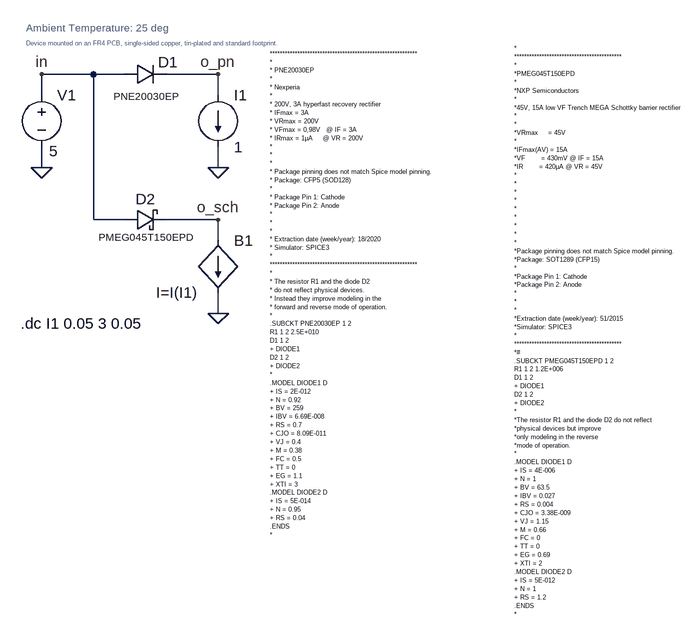
[diagram p0: schematic 02-direct_bias_pn_sch.asc]
02-direct_bias_pn_sch.asc, the LTspice schematic file:
Version 4
SHEET 1 1284 1908
WIRE -16 64 -96 64
WIRE 32 64 -16 64
WIRE 176 64 96 64
WIRE -96 96 -96 64
WIRE 176 96 176 64
WIRE -96 208 -96 176
WIRE 176 208 176 176
WIRE -16 288 -16 64
WIRE 32 288 -16 288
WIRE 176 288 96 288
WIRE 176 320 176 288
WIRE 176 432 176 400
FLAG -96 208 0
FLAG 176 208 0
FLAG -96 64 in
FLAG 176 64 o_pn
FLAG 176 432 0
FLAG 176 288 o_sch
SYMBOL diode 32 80 R270
WINDOW 0 19 67 VTop 2
WINDOW 3 -7 32 VBottom 1
SYMATTR InstName D1
SYMATTR Value PNE20030EP
SYMATTR Prefix X
SYMBOL voltage -96 80 R0
WINDOW 3 12 102 Left 2
WINDOW 123 0 0 Left 0
WINDOW 39 0 0 Left 0
SYMATTR Value 5
SYMATTR InstName V1
SYMBOL current 176 96 R0
WINDOW 123 0 0 Left 0
WINDOW 39 0 0 Left 0
SYMATTR InstName I1
SYMATTR Value 1
SYMBOL schottky 32 304 R270
WINDOW 0 32 32 VTop 2
WINDOW 3 0 32 VBottom 1
SYMATTR InstName D2
SYMATTR Value PMEG045T150EPD
SYMATTR Prefix X
SYMBOL bi 176 320 R0
WINDOW 3 -96 80 Left 2
SYMATTR InstName B1
SYMATTR Value I=I(I1)
TEXT 256 32 Left 0 !***********************************************************\n*\n* PNE20030EP\n*\n* Nexperia\n*\n* 200V, 3A hyperfast recovery rectifier\n* IFmax = 3A\n* VRmax = 200V\n* VFmax = 0,98V   @ IF = 3A\n* IRmax = 1µA     @ VR = 200V\n* \n*\n*\n* Package pinning does not match Spice model pinning.\n* Package: CFP5 (SOD128)\n* \n* Package Pin 1: Cathode\n* Package Pin 2: Anode\n* \n*\n*\n* Extraction date (week/year): 18/2020\n* Simulator: SPICE3\n*\n***********************************************************\n*\n* The resistor R1 and the diode D2  \n* do not reflect physical devices.\n* Instead they improve modeling in the \n* forward and reverse mode of operation.\n*\n.SUBCKT PNE20030EP 1 2\nR1 1 2 2.5E+010\nD1 1 2\n+ DIODE1\nD2 1 2\n+ DIODE2\n*\n.MODEL DIODE1 D\n+ IS = 2E-012\n+ N = 0.92\n+ BV = 259\n+ IBV = 6.69E-008\n+ RS = 0.7\n+ CJO = 8.09E-011\n+ VJ = 0.4\n+ M = 0.38\n+ FC = 0.5\n+ TT = 0\n+ EG = 1.1\n+ XTI = 3\n.MODEL DIODE2 D\n+ IS = 5E-014\n+ N = 0.95\n+ RS = 0.04\n.ENDS\n*
TEXT -128 448 Left 2 !.dc I1 0.05 3 0.05
TEXT -120 16 Left 0 ;Device mounted on an FR4 PCB, single-sided copper, tin-plated and standard footprint.
TEXT -120 -8 Left 1 ;Ambient Temperature: 25 deg
TEXT 632 24 Left 0 !*\n*******************************************\n*\n*PMEG045T150EPD\n*\n*NXP Semiconductors\n*\n*45V, 15A low VF Trench MEGA Schottky barrier rectifier\n*\n*\n*VRmax     = 45V \n*\n*IFmax(AV) = 15A \n*VF        = 430mV @ IF = 15A\n*IR        = 420µA @ VR = 45V\n*\n*\n*\n*\n*\n*\n*\n*\n*\n*Package pinning does not match Spice model pinning.\n*Package: SOT1289 (CFP15)\n*\n*Package Pin 1: Cathode \n*Package Pin 2: Anode \n* \n*\n*\n*Extraction date (week/year): 51/2015\n*Simulator: SPICE3\n*\n*******************************************\n*#\n.SUBCKT PMEG045T150EPD 1 2\nR1 1 2 1.2E+006\nD1 1 2\n+ DIODE1\nD2 1 2\n+ DIODE2\n*\n*The resistor R1 and the diode D2 do not reflect \n*physical devices but improve \n*only modeling in the reverse \n*mode of operation.\n*\n.MODEL DIODE1 D\n+ IS = 4E-006\n+ N = 1\n+ BV = 63.5\n+ IBV = 0.027\n+ RS = 0.004\n+ CJO = 3.38E-009\n+ VJ = 1.15\n+ M = 0.66\n+ FC = 0\n+ TT = 0\n+ EG = 0.69\n+ XTI = 2\n.MODEL DIODE2 D\n+ IS = 5E-012\n+ N = 1\n+ RS = 1.2\n.ENDS\n*

The netlist it stands for:
* 02-direct_bias_pn_sch.asc
XD1 in o_pn PNE20030EP  ; pins + -
V1 in 0 5
I1 o_pn 0 1
XD2 in o_sch PMEG045T150EPD  ; pins + -
B1 o_sch 0 I=I(I1)
***********************************************************
*
* PNE20030EP
*
* Nexperia
*
* 200V, 3A hyperfast recovery rectifier
* IFmax = 3A
* VRmax = 200V
* VFmax = 0,98V   @ IF = 3A
* IRmax = 1µA     @ VR = 200V
*
*
*
* Package pinning does not match Spice model pinning.
* Package: CFP5 (SOD128)
*
* Package Pin 1: Cathode
* Package Pin 2: Anode
*
*
*
* Extraction date (week/year): 18/2020
* Simulator: SPICE3
*
***********************************************************
*
* The resistor R1 and the diode D2
* do not reflect physical devices.
* Instead they improve modeling in the
* forward and reverse mode of operation.
*
.SUBCKT PNE20030EP 1 2
R1 1 2 2.5E+010
D1 1 2
+ DIODE1
D2 1 2
+ DIODE2
*
.MODEL DIODE1 D
+ IS = 2E-012
+ N = 0.92
+ BV = 259
+ IBV = 6.69E-008
+ RS = 0.7
+ CJO = 8.09E-011
+ VJ = 0.4
+ M = 0.38
+ FC = 0.5
+ TT = 0
+ EG = 1.1
+ XTI = 3
.MODEL DIODE2 D
+ IS = 5E-014
+ N = 0.95
+ RS = 0.04
.ENDS
*
.dc I1 0.05 3 0.05
* Device mounted on an FR4 PCB, single-sided copper, tin-plated and standard footprint.
* Ambient Temperature: 25 deg
*
*******************************************
*
*PMEG045T150EPD
*
*NXP Semiconductors
*
*45V, 15A low VF Trench MEGA Schottky barrier rectifier
*
*
*VRmax     = 45V
*
*IFmax(AV) = 15A
*VF        = 430mV @ IF = 15A
*IR        = 420µA @ VR = 45V
*
*
*
*
*
*
*
*
*
*Package pinning does not match Spice model pinning.
*Package: SOT1289 (CFP15)
*
*Package Pin 1: Cathode
*Package Pin 2: Anode
*
*
*
*Extraction date (week/year): 51/2015
*Simulator: SPICE3
*
*******************************************
*#
.SUBCKT PMEG045T150EPD 1 2
R1 1 2 1.2E+006
D1 1 2
+ DIODE1
D2 1 2
+ DIODE2
*
*The resistor R1 and the diode D2 do not reflect
*physical devices but improve
*only modeling in the reverse
*mode of operation.
*
.MODEL DIODE1 D
+ IS = 4E-006
+ N = 1
+ BV = 63.5
+ IBV = 0.027
+ RS = 0.004
+ CJO = 3.38E-009
+ VJ = 1.15
+ M = 0.66
+ FC = 0
+ TT = 0
+ EG = 0.69
+ XTI = 2
.MODEL DIODE2 D
+ IS = 5E-012
+ N = 1
+ RS = 1.2
.ENDS
*
.backanno
.end

* Results of the author's LTspice run, read from the files saved beside the schematic
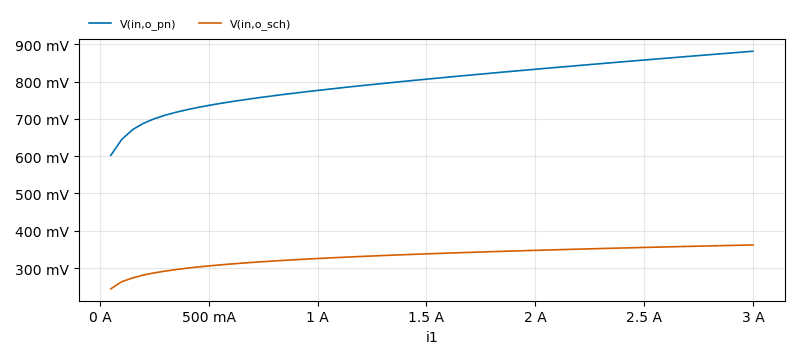
[diagram p1: DC transfer characteristic of 02-direct_bias_pn_sch.asc, plotted from the saved traces]
* DC transfer characteristic, 1 run:
*   V(in,o_pn): 602.1 mV at i1=50 mA, 881.2 mV at i1=3 A, min 602.1 mV, max 881.2 mV
*   V(in,o_sch): 244.2 mV at i1=50 mA, 361.9 mV at i1=3 A, min 244.2 mV, max 361.9 mV